# Altium schematic sheet Charge.SchDoc
size A
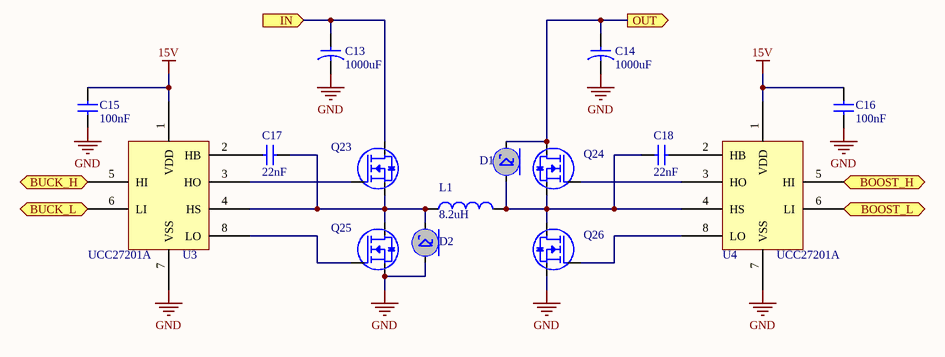
[diagram p0: Charge.SchDoc]

## Parts
C13  value 1000uF  [CAP1000uF]  (hidden comment: CapPol)
C14  value 1000uF  [CAP1000uF]  (hidden comment: CapPol)
C15  value 100nF  [CAPC0603]  (hidden comment: Cap)
C16  value 100nF  [CAPC0603]  (hidden comment: Cap)
C17  value 22nF  [CAPC0603]  (hidden comment: Cap)
C18  value 22nF  [CAPC0603]  (hidden comment: Cap)
D1  DFLS160  [POWERDI123]  (value not drawn)
D2  DFLS160  [POWERDI123]  (value not drawn)
L1  Inductance: 8.2uH  [IHLP-6767]  (hidden comment: Inductor)
Q23  IRFB3306PbF  [TO-220AB Heatsink]  (value not drawn)
Q24  IRFB3306PbF  [TO-220AB Heatsink]  (value not drawn)
Q25  IRFB3306PbF  [TO-220AB Heatsink]  (value not drawn)
Q26  IRFB3306PbF  [TO-220AB Heatsink]  (value not drawn)
U3  UCC27201A  [UCC27201A]
U4  UCC27201A  [UCC27201A]

## Ports
BOOST_H (in), BOOST_L (in), BUCK_H (in), BUCK_L (in), IN (in), OUT (out)

## Nets
15V: C15.1(A) C16.1(A) U3.1(VDD) U4.1(VDD)
GND: C13.2(B) C14.2(B) C15.2(B) C16.2(B) D2.A Q25.S Q26.S U3.7(VSS) U4.7(VSS)
BOOST_H: U4.5(HI) ; port BOOST_H
BOOST_L: U4.6(LI) ; port BOOST_L
BUCK_H: U3.5(HI) ; port BUCK_H
BUCK_L: U3.6(LI) ; port BUCK_L
IN: C13.1(A) Q23.D ; port IN
OUT: C14.1(A) D1.C Q24.D ; port OUT
NetC17_1: C17.1(A) D2.C L1.1(A) Q23.S Q25.D U3.4(HS)
NetC17_2: C17.2(B) U3.2(HB)
NetC18_1: C18.1(A) D1.A L1.2(B) Q24.S Q26.D U4.4(HS)
NetC18_2: C18.2(B) U4.2(HB)
NetQ23_G: Q23.G U3.3(HO)
NetQ24_G: Q24.G U4.3(HO)
NetQ25_G: Q25.G U3.8(LO)
NetQ26_G: Q26.G U4.8(LO)

## Library data of the parts
D1 D2 = DFLS160: 1.0A Surface Mount Schottky Barrier Rectifier; Supplier 1: Digi-Key; Supplier Part Number 1: DFLS160DICT-ND
Q23-Q26 = IRFx3306PbF: HEXFET Power MOSFET; Heatsink: A10755-ND; Supplier 1: Digi-Key; Supplier Part Number 1: IRFB3306PBF-ND
U3 U4 = UCC27201A: IC DVR HIGH/LOW SIDE 3A 8SOPWR; Supplier 1: Digi-Key; Supplier Part Number 1: 296-28428-1-ND
C13 C14 = CapPol: Supplier 1: Digi-Key; Supplier Part Number 1: 565-1618-ND
C15-C18 = Cap: Supplier 1: Digi-Key
  C15 C16: Supplier Part Number 1: 1276-1000-1-ND
  C17 C18: Supplier Part Number 1: 445-2275-1-ND
L1 = Inductor: Supplier 1: Digi-Key; Supplier Part Number 1: 541-1285-1-ND